# Altium schematic sheet Pin Decoupling.SchDoc: Pin Decoupling
size A4; SheetNumber: 3; SheetTotal: 3
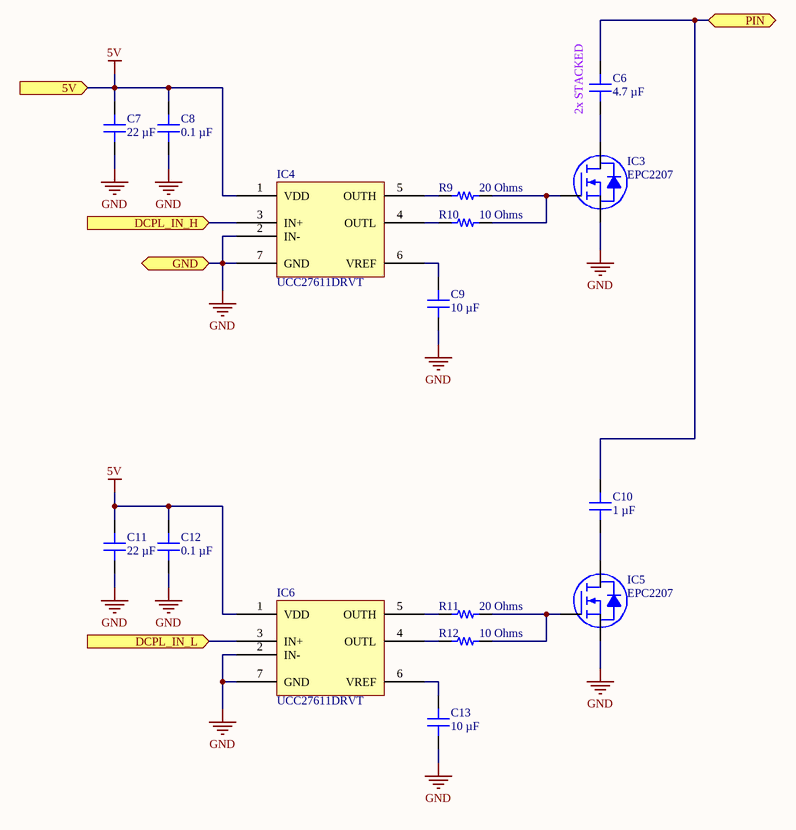
[diagram p0: Pin Decoupling.SchDoc]

## Parts
C6  4.7 µF  [CAP 1206_3216 - 0.8MM]
C7  22 µF  [CAP 0603_1608]
C8  0.1 µF  [CAP 0603_1608]
C9  10 µF  [CAP 0603_1608]
C10  1 µF  [CAP 1206_3216 - 0.8MM]
C11  22 µF  [CAP 0603_1608]
C12  0.1 µF  [CAP 0603_1608]
C13  10 µF  [CAP 0603_1608]
IC3  EPC2207  [EPC EPC2207]
IC4  UCC27611DRVT  [TI WSON-6 DRV0006D 2x2MM]
IC5  EPC2207  [EPC EPC2207]
IC6  UCC27611DRVT  [TI WSON-6 DRV0006D 2x2MM]
R9  20 Ohms  [RES 0603_1608]
R10  10 Ohms  [RES 0603_1608]
R11  20 Ohms  [RES 0603_1608]
R12  10 Ohms  [RES 0603_1608]

## Ports
5V (in, see DUT Pin[2B], Pin Function Relays[1A]), DCPL_IN_H (in, see DUT Pin[3B]), DCPL_IN_L (in, see DUT Pin[3B]), GND (bidir, see DUT Pin[2B], Pin Function Relays[3D]), PIN (bidir, see DUT Pin[2B], Pin Function Relays[3A])

## Nets
5V: C7.2 C8.2 C11.2 C12.2 IC4.1(VDD) IC6.1(VDD) ; port 5V
GND: C7.1 C8.1 C9.1 C11.1 C12.1 C13.1 IC3.S IC4.2(IN-) IC4.7(GND) IC5.S IC6.2(IN-) IC6.7(GND) ; port GND
DCPL_IN_H: IC4.3(IN+) ; port DCPL_IN_H
DCPL_IN_L: IC6.3(IN+) ; port DCPL_IN_L
PIN: C6.2 C10.2 ; port PIN
NetC6_1: C6.1 IC3.D
NetC9_2: C9.2 IC4.6(VREF)
NetC10_1: C10.1 IC5.D
NetC13_2: C13.2 IC6.6(VREF)
NetIC3_G: IC3.G R9.2 R10.2
NetIC4_4: IC4.4(OUTL) R10.1
NetIC4_5: IC4.5(OUTH) R9.1
NetIC5_G: IC5.G R11.2 R12.2
NetIC6_4: IC6.4(OUTL) R12.1
NetIC6_5: IC6.5(OUTH) R11.1

## Notes on the sheet
- (near C6) 2x STACKED
- Title
- Size:
- Date:
- A4
- Number:
- Time:
- Revision:
- Sheet
- of
- File:

## Library data of the parts
C6 = GRJ31CZ72A475KE01L: CAP CER 4.7UF 100V X7R 1206; manufacturer: Murata Electronics; Tolerance: ±10%; Part Number: GRJ31CZ72A475KE01L; Value: 4.7 µF; Applications: Boardflex Sensitive; Capacitance: 4.7 µF; componentlink1description: Datasheet; componentlink1url: https://search.murata.co.jp/Ceramy/image/img/A01X/G101/ENG/GRJ31CZ72A475KE01-01.pdf; componentlink2description: DigiKey Link; componentlink2url: https://www.digikey.com/en/products/detail/murata-electronics/GRJ31CZ72A475KE01L/16033704; Device Package: 1206 (3216 Metric); Features: Soft Termination; lastupdated: 20/08/2023 19:15:38; Lifecycle Status: Active; Minimum Order: 1; Mounting Type: Surface Mount, MLCC; Operating Temperature: -55°C ~ 125°C; Package / Case: 1206 (3216 Metric); packaging: TapeAndReel; partid: 42915; Part Status: Active; price: 0.20; series: GRJ; Size / Dimension: 0.126" L x 0.063" W (3.20mm x 1.60mm); Supplier 1: DigiKey; Supplier Part Number 1: 490-GRJ31CZ72A475KE01LCT-ND; Temperature Coefficient: X7R; Thickness (Max): 0.075" (1.90mm); Voltage - Rated: 100V
C7 C11 = ZRB18AR61A226ME01L: CAP CER 22UF 10V X5R 0603; manufacturer: Murata Electronics; Tolerance: ±20%; Part Number: ZRB18AR61A226ME01L; Value: 22 µF; Applications: Acoustic Noise Reduction; Capacitance: 22 µF; componentlink1description: Datasheet; componentlink1url: https://search.murata.co.jp/Ceramy/image/img/A01X/G101/ENG/ZRB18AR61A226ME01-02.pdf; componentlink2description: DigiKey Link; componentlink2url: https://www.digikey.com/en/products/detail/murata-electronics/ZRB18AR61A226ME01L/7243452; Device Package: 0603 (1608 Metric); Features: Interposer Termination; lastupdated: 20/08/2023 19:08:34; Lifecycle Status: Active; Minimum Order: 1; Mounting Type: Surface Mount, MLCC; Operating Temperature: -55°C ~ 85°C; Package / Case: 0603 (1608 Metric); packaging: TapeAndReel; partid: 34379; Part Status: Active; price: 0.05; series: ZRB; Size / Dimension: 0.063" L x 0.031" W (1.60mm x 0.80mm); Supplier 1: DigiKey; Supplier Part Number 1: 490-ZRB18AR61A226ME01LCT-ND; Temperature Coefficient: X5R; Thickness (Max): 0.047" (1.20mm); Voltage - Rated: 10V
C8 C12 = CL10B104KB8NNNC: CAP CER 0.1UF 50V X7R 0603; manufacturer: Samsung Electro-Mechanics; Tolerance: ±10%; Part Number: CL10B104KB8NNNC; Value: 0.1 µF; Applications: General Purpose; Capacitance: 0.1 µF; componentlink1description: Datasheet; componentlink1url: http://www.samsungsem.com/kr/support/product-search/mlcc/CL10B104KB8NNNC.jsp; componentlink2description: DigiKey Link; componentlink2url: https://www.digikey.com/en/products/detail/samsung-electro-mechanics/CL10B104KB8NNNC/3886658; Device Package: 0603 (1608 Metric); lastupdated: 20/08/2023 19:09:00; Lifecycle Status: Active; Minimum Order: 1; Mounting Type: Surface Mount, MLCC; Operating Temperature: -55°C ~ 125°C; Package / Case: 0603 (1608 Metric); packaging: TapeAndReel; partid: 9788; Part Status: Active; price: 0.01; series: CL; Size / Dimension: 0.063" L x 0.031" W (1.60mm x 0.80mm); Supplier 1: DigiKey; Supplier Part Number 1: 1276-1000-1-ND; Temperature Coefficient: X7R; Thickness (Max): 0.035" (0.90mm); Voltage - Rated: 50V
C9 C13 = GRM188R61A106ME69J: CAP CER 10UF 10V X5R 0603; manufacturer: Murata Electronics; Tolerance: ±20%; Part Number: GRM188R61A106ME69J; Value: 10 µF; Applications: General Purpose; Capacitance: 10 µF; componentlink2description: DigiKey Link; componentlink2url: https://www.digikey.com/en/products/detail/murata-electronics/GRM188R61A106ME69J/10695932; Device Package: 0603 (1608 Metric); lastupdated: 20/08/2023 19:07:38; Lifecycle Status: Active; Minimum Order: 1; Mounting Type: Surface Mount, MLCC; Operating Temperature: -55°C ~ 85°C; Package / Case: 0603 (1608 Metric); packaging: TapeAndReel; partid: 54715; Part Status: Active; price: 0.01; series: GRM; Size / Dimension: 0.063" L x 0.032" W (1.60mm x 0.80mm); Supplier 1: DigiKey; Supplier Part Number 1: 490-GRM188R61A106ME69JCT-ND; Temperature Coefficient: X5R; Thickness (Max): 0.037" (0.95mm); Voltage - Rated: 10V
C10 = GCJ31CR72A105KA01L: CAP CER 1UF 100V X7R 1206; manufacturer: Murata Electronics; Tolerance: ±10%; Part Number: GCJ31CR72A105KA01L; Value: 1 µF; Applications: Automotive, Boardflex Sensitive; Capacitance: 1 µF; componentlink1description: Datasheet; componentlink1url: https://search.murata.co.jp/Ceramy/image/img/A01X/G101/ENG/GCJ31CR72A105KA01-01.pdf; componentlink2description: DigiKey Link; componentlink2url: https://www.digikey.com/en/products/detail/murata-electronics/GCJ31CR72A105KA01L/7363212; Device Package: 1206 (3216 Metric); Features: Soft Termination; lastupdated: 20/08/2023 19:16:17; Lifecycle Status: Active; Minimum Order: 1; Mounting Type: Surface Mount, MLCC; Operating Temperature: -55°C ~ 125°C; Package / Case: 1206 (3216 Metric); packaging: TapeAndReel; partid: 44338; Part Status: Active; price: 0.11; Ratings: AEC-Q200; series: GCJ; Size / Dimension: 0.126" L x 0.063" W (3.20mm x 1.60mm); Supplier 1: DigiKey; Supplier Part Number 1: 490-16468-1-ND; Temperature Coefficient: X7R; Thickness (Max): 0.075" (1.90mm); Voltage - Rated: 100V
IC3 IC5 = EPC2207: TRANS GAN 200V DIE .022OHM; Manufacturer: EPC; Current - Continuous Drain (Id) @ 25°C: 14A (Ta); Drive Voltage (Max Rds On,  Min Rds On): 5V; FET Type: N-Channel; Gate Charge (Qg) (Max) @ Vgs: 5.9 nC @ 5 V; Input Capacitance (Ciss) (Max) @ Vds: 600 pF @ 100 V; Rds On (Max) @ Id, Vgs: 22mOhm @ 14A, 5V; Vgs (Max): +6V, -4V; Vgs(th) (Max) @ Id: 2.5V @ 2mA; Part Number: EPC2207; ComponentLink1Description: Datasheet; ComponentLink1URL: https://epc-co.com/epc/Portals/0/epc/documents/datasheets/EPC2207_datasheet.pdf; ComponentLink2Description: DigiKey Link; ComponentLink2URL: https://www.digikey.com/en/products/detail/epc/EPC2207/12821510; Drain to Source Voltage (Vdss): 200 V; LastUpdated: 21/08/2023 03:24:17; Lifecycle Status: Active; Minimum Order: 1; Mounting Type: Surface Mount; Operating Temperature: -40°C ~ 150°C (TJ); Packaging: TapeAndReel; Part Status: Active; Price: 1.45; Series: -; Supplier 1: DigiKey; Supplier Part Number 1: 917-EPC2207CT-ND; Supplier Device Package: Die; Technology: GaNFET (Gallium Nitride)
IC4 IC6 = UCC27611DRVT: IC GATE DRVR LOW-SIDE 6WSON; Manufacturer: Texas Instruments; Channel Type: Single; Current - Peak Output (Source, Sink): 4A, 6A; Gate Type: N-Channel MOSFET; Input Type: Inverting, Non-Inverting; Logic Voltage - VIL, VIH: 1.3V, 1.85V; Number of Drivers: 1; Rise / Fall Time (Typ): 5ns, 5ns; Voltage - Supply: 4V ~ 18V; Part Number: UCC27611DRVT; ComponentLink1Description: Datasheet; ComponentLink1URL: http://www.ti.com/general/docs/suppproductinfo.tsp?distId=10&gotoUrl=http%3A%2F%2Fwww.ti.com%2Flit%2Fgpn%2Fucc27611; ComponentLink2Description: DigiKey Link; ComponentLink2URL: https://www.digikey.com/en/products/detail/texas-instruments/UCC27611DRVT/3871279; Driven Configuration: Low-Side; LastUpdated: 21/08/2023 01:53:28; Lifecycle Status: Active; Minimum Order: 1; Mounting Type: Surface Mount; Operating Temperature: -40°C ~ 140°C (TJ); Package / Case: 6-WDFN Exposed Pad; Packaging: TapeAndReel; PartId: 28; Part Status: Active; Price: 1.10; Series: -; Supplier 1: DigiKey; Supplier Part Number 1: 296-35639-1-ND; Supplier Device Package: 6-WSON (2x2)
R9 R11 = ERJ-3EKF20R0V: RES SMD 20 OHM 1% 1/10W 0603; Manufacturer: Panasonic Electronic Components; Power (Watts): 0.1W, 1/10W; Temperature Coefficient: ±100ppm/°C; Part Number: ERJ-3EKF20R0V; Value: 20 Ohms; ComponentLink1Description: Datasheet; ComponentLink1URL: https://industrial.panasonic.com/cdbs/www-data/pdf/RDA0000/AOA0000C304.pdf; ComponentLink2Description: DigiKey Link; ComponentLink2URL: https://www.digikey.com/en/products/detail/panasonic-electronic-components/ERJ-3EKF20R0V/196201; Composition: Thick Film; Device Package: 0603 (1608 Metric); Features: Automotive AEC-Q200; Height - Seated (Max): 0.022" (0.55mm); LastUpdated: 20/08/2023 19:34:39; Lifecycle Status: Active; Minimum Order: 1; Number of Terminations: 2; Operating Temperature: -55°C ~ 155°C; Package / Case: 0603 (1608 Metric); Packaging: TapeAndReel; PartId: 23067; Part Status: Active; Price: 0.01; Ratings: AEC-Q200; Resistance: 20 Ohms; Series: ERJ-3EK; Size / Dimension: 0.063" L x 0.031" W (1.60mm x 0.80mm); Supplier 1: DigiKey; Supplier Part Number 1: P20.0HCT-ND; Supplier Device Package: 0603; Tolerance: ±1%
R10 R12 = ERJ-3EKF10R0V: RES SMD 10 OHM 1% 1/10W 0603; Manufacturer: Panasonic Electronic Components; Power (Watts): 0.1W, 1/10W; Temperature Coefficient: ±100ppm/°C; Part Number: ERJ-3EKF10R0V; Value: 10 Ohms; ComponentLink1Description: Datasheet; ComponentLink1URL: https://industrial.panasonic.com/cdbs/www-data/pdf/RDA0000/AOA0000C304.pdf; ComponentLink2Description: DigiKey Link; ComponentLink2URL: https://www.digikey.com/en/products/detail/panasonic-electronic-components/ERJ-3EKF10R0V/196065; Composition: Thick Film; Device Package: 0603 (1608 Metric); Features: Automotive AEC-Q200; Height - Seated (Max): 0.022" (0.55mm); LastUpdated: 20/08/2023 19:35:53; Lifecycle Status: Active; Minimum Order: 1; Number of Terminations: 2; Operating Temperature: -55°C ~ 155°C; Package / Case: 0603 (1608 Metric); Packaging: TapeAndReel; PartId: 5647; Part Status: Active; Price: 0.01; Ratings: AEC-Q200; Resistance: 10 Ohms; Series: ERJ-3EK; Size / Dimension: 0.063" L x 0.031" W (1.60mm x 0.80mm); Supplier 1: DigiKey; Supplier Part Number 1: P10.0HCT-ND; Supplier Device Package: 0603; Tolerance: ±1%